# Altium project PCB_Project.PrjPcb (part 1 of 3)
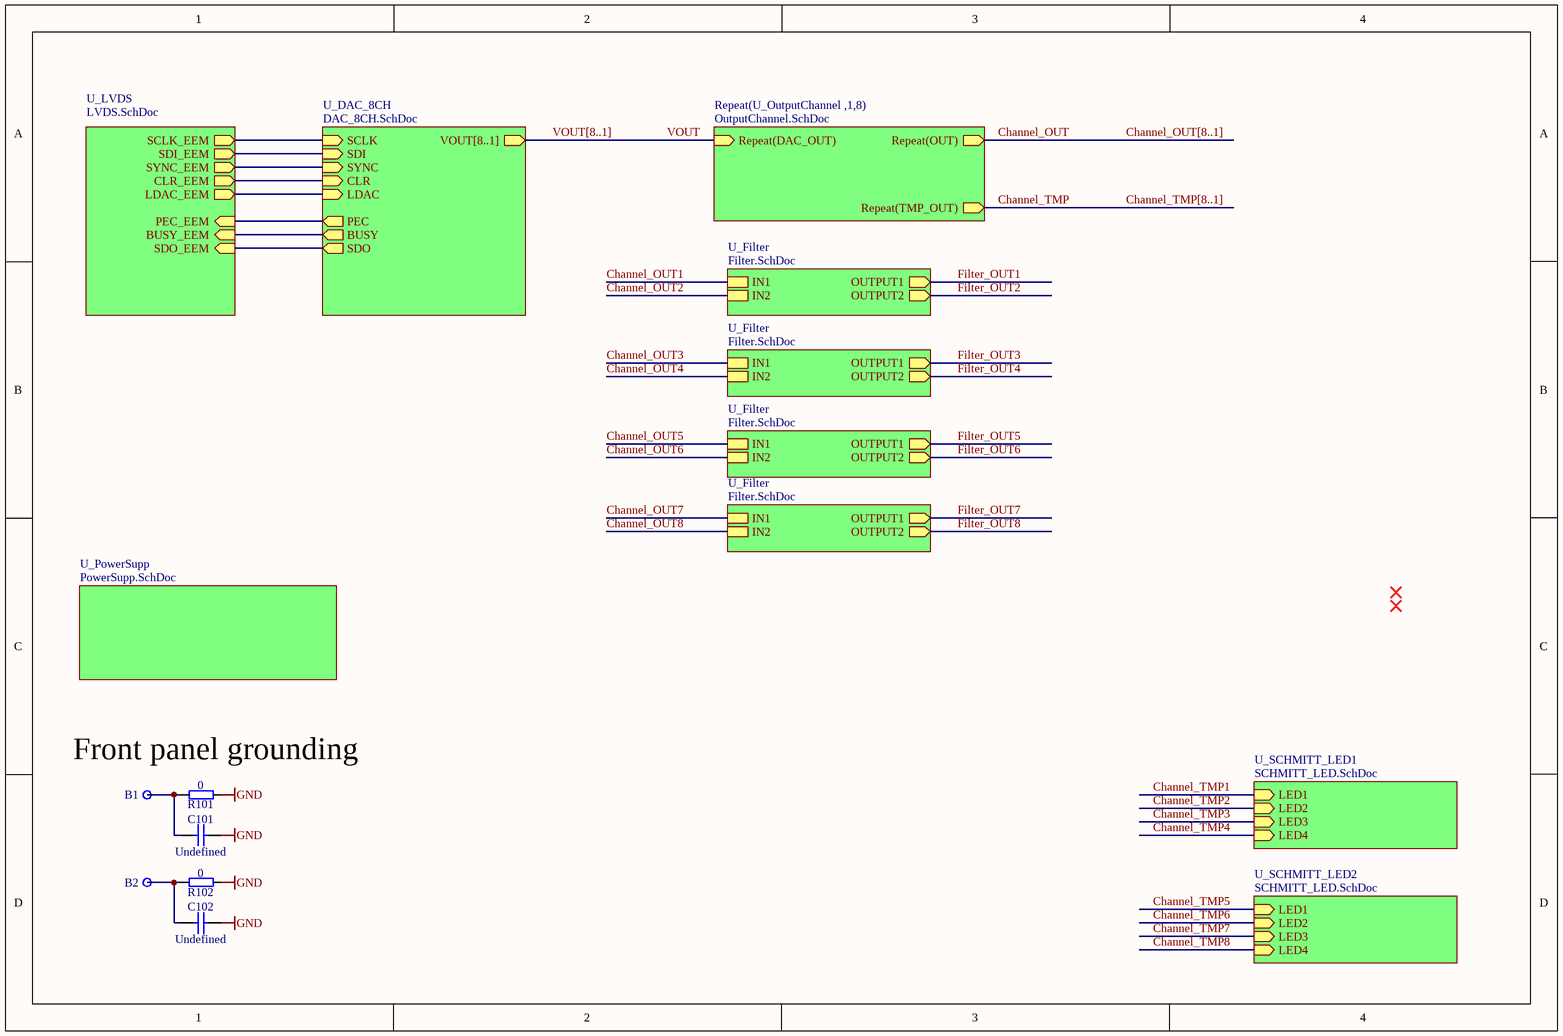
[diagram p0: Zapper.SchDoc]
7 sheets, 397 parts. Net scope: hierarchical (ports join the sheet entries above them; power ports are global).
Sheets:
  Zapper.SchDoc
    U_LVDS = LVDS.SchDoc
    U_DAC_8CH = DAC_8CH.SchDoc
    U_SCHMITT_LED1 = SCHMITT_LED.SchDoc
    U_SCHMITT_LED2 = SCHMITT_LED.SchDoc
    U_OutputChannel1 = OutputChannel.SchDoc
    U_OutputChannel2 = OutputChannel.SchDoc
    U_OutputChannel3 = OutputChannel.SchDoc
    U_OutputChannel4 = OutputChannel.SchDoc
    U_OutputChannel5 = OutputChannel.SchDoc
    U_OutputChannel6 = OutputChannel.SchDoc
    U_OutputChannel7 = OutputChannel.SchDoc
    U_OutputChannel8 = OutputChannel.SchDoc
    U_PowerSupp = PowerSupp.SchDoc
    U_Filter = Filter.SchDoc
    U_Filter = Filter.SchDoc
    U_Filter = Filter.SchDoc
    U_Filter = Filter.SchDoc

## Sheet Zapper.SchDoc
size A4

### Parts
B1  Plated Hole  [MTG270_500]  (value not drawn)
B2  Plated Hole  [MTG270_500]  (value not drawn)
C101  Undefined  [CAPC2012X135N]
C102  Undefined  [CAPC2012X135N]
R101  0  [RESC1608X55N]
R102  0  [RESC1608X55N]

### Sub-sheets
Repeat(U_OutputChannel ,1,8) = OutputChannel.SchDoc: Repeat(OUT) (out), Repeat(DAC_OUT) (in), Repeat(TMP_OUT) (out)
U_DAC_8CH = DAC_8CH.SchDoc: SCLK (in), SDI (in), SYNC (in), BUSY (out), CLR (in), LDAC (in), PEC (out), SDO (out), VOUT[8..1] (out)
U_Filter = Filter.SchDoc: IN1, IN2, OUTPUT1 (out), OUTPUT2 (out)
U_Filter = Filter.SchDoc: IN1, IN2, OUTPUT1 (out), OUTPUT2 (out)
U_Filter = Filter.SchDoc: IN1, IN2, OUTPUT1 (out), OUTPUT2 (out)
U_Filter = Filter.SchDoc: IN1, IN2, OUTPUT1 (out), OUTPUT2 (out)
U_LVDS = LVDS.SchDoc: SCLK_EEM (out), SDO_EEM (in), SDI_EEM (out), SYNC_EEM (out), CLR_EEM (out), BUSY_EEM (in), LDAC_EEM (out), PEC_EEM (in)
U_PowerSupp = PowerSupp.SchDoc: no entries
U_SCHMITT_LED1 = SCHMITT_LED.SchDoc: LED1 (in), LED2 (in), LED3 (in), LED4 (in)
U_SCHMITT_LED2 = SCHMITT_LED.SchDoc: LED1 (in), LED2 (in), LED3 (in), LED4 (in)

### Nets
GND: C101.2 C102.2 R101.1 R102.1
Channel_OUT: sheet Repeat(U_OutputChannel ,1,8)/Repeat(OUT)
Channel_TMP: sheet Repeat(U_OutputChannel ,1,8)/Repeat(TMP_OUT)
VOUT: sheet Repeat(U_OutputChannel ,1,8)/Repeat(DAC_OUT)
NetB1_1: B1.1 C101.1 R101.2
NetB2_1: B2.1 C102.1 R102.2
NetIC1_26: sheet U_LVDS/SYNC_EEM, sheet U_DAC_8CH/SYNC
NetIC1_28: sheet U_LVDS/SDO_EEM, sheet U_DAC_8CH/SDO
NetIC1_33: sheet U_LVDS/SDI_EEM, sheet U_DAC_8CH/SDI
NetIC1_36: sheet U_LVDS/SCLK_EEM, sheet U_DAC_8CH/SCLK
NetIC2_26: sheet U_LVDS/CLR_EEM, sheet U_DAC_8CH/CLR
NetIC2_28: sheet U_LVDS/BUSY_EEM, sheet U_DAC_8CH/BUSY
NetIC2_33: sheet U_LVDS/LDAC_EEM, sheet U_DAC_8CH/LDAC
NetIC2_35: sheet U_LVDS/PEC_EEM, sheet U_DAC_8CH/PEC

### Buses and harness runs
bus Channel_OUT[8..1]
bus Channel_TMP[8..1]
bus VOUT[8..1] = sheet U_DAC_8CH/VOUT[8..1]

### Notes on the sheet
- Front panel grounding

### Library data of the parts
B1 B2 = PLATED_HOLE2.7_PAD5.0: Single Terminal Socket; Part Description: Plated Through Hole: Hole Dia.=2.7mm Pad Dia.=5.0mm; Mounted: No; Part Number: PLATED_HOLE2.7_PAD5.0; Component Kind: Standard (No BOM); Component Type: Standard (No BOM); Pin Count: 1; Family: Plated Hole; Socket: No; SMD: No; Sense: No; Status: None; ComponentHeight: 0mm; HelpURL: Undefined; Author: CERN DEM JMW; CreateDate: 27.09.2011; LatestRevisionDate: 27.09.2011; PackageDescription: Plated Through Hole: Hole Dia.=2.7mm Pad Dia.=5.0mm
C101 C102 = CC0805_NO-VALUE: Non-polarised capacitor; Part Description: Reserved Footprint For 0805(2012) Chip Ceramic Capacitor; Mounted: No; Part Number: CC0805_NO-VALUE; Component Kind: Standard; Component Type: Standard; Pin Count: 2; Value: Undefined; Status: None; Manufacturer: Undefined; Manufacturer Part Number: CC0805_NO-VALUE; Case: 0805; Socket: No; SMD: Yes; Sense: No; Manufacturer1 ComponentHeight: 1.35mm; HelpURL: Undefined; Author: CERN DEM JLC; CreateDate: 10.12.2008; LatestRevisionDate: 11.09.2013
R101 R102 = R0603_0R_JUMPER: Resistor; Part Description: 1A (0.05R Max DC Resistance) Zero Ohm Jumper; Manufacturer: GENERIC; Manufacturer1 Part Number: NRC06Z0; PressFit: No; Part Number: R0603_0R_JUMPER; Component Kind: Standard; Component Type: Standard; Pin Count: 2; Value: 0; Status: Preferred; Manufacturer Part Number: R0603_0R_JUMPER; Case: 0603; Mounted: Yes; Sense: No; Socket: No; SMD: Yes; Manufacturer1 Example: NIC COMPONENT; Manufacturer1 ComponentHeight: 0.55mm; HelpURL: \\cern.ch\dfs\Applications\Altium\Datasheets\R0603_NIC_NRC.pdf; Author: CERN DEM JLC; CreateDate: 03.12.2007; LatestRevisionDate: 13.03.2008

## Sheet LVDS.SchDoc
size A4
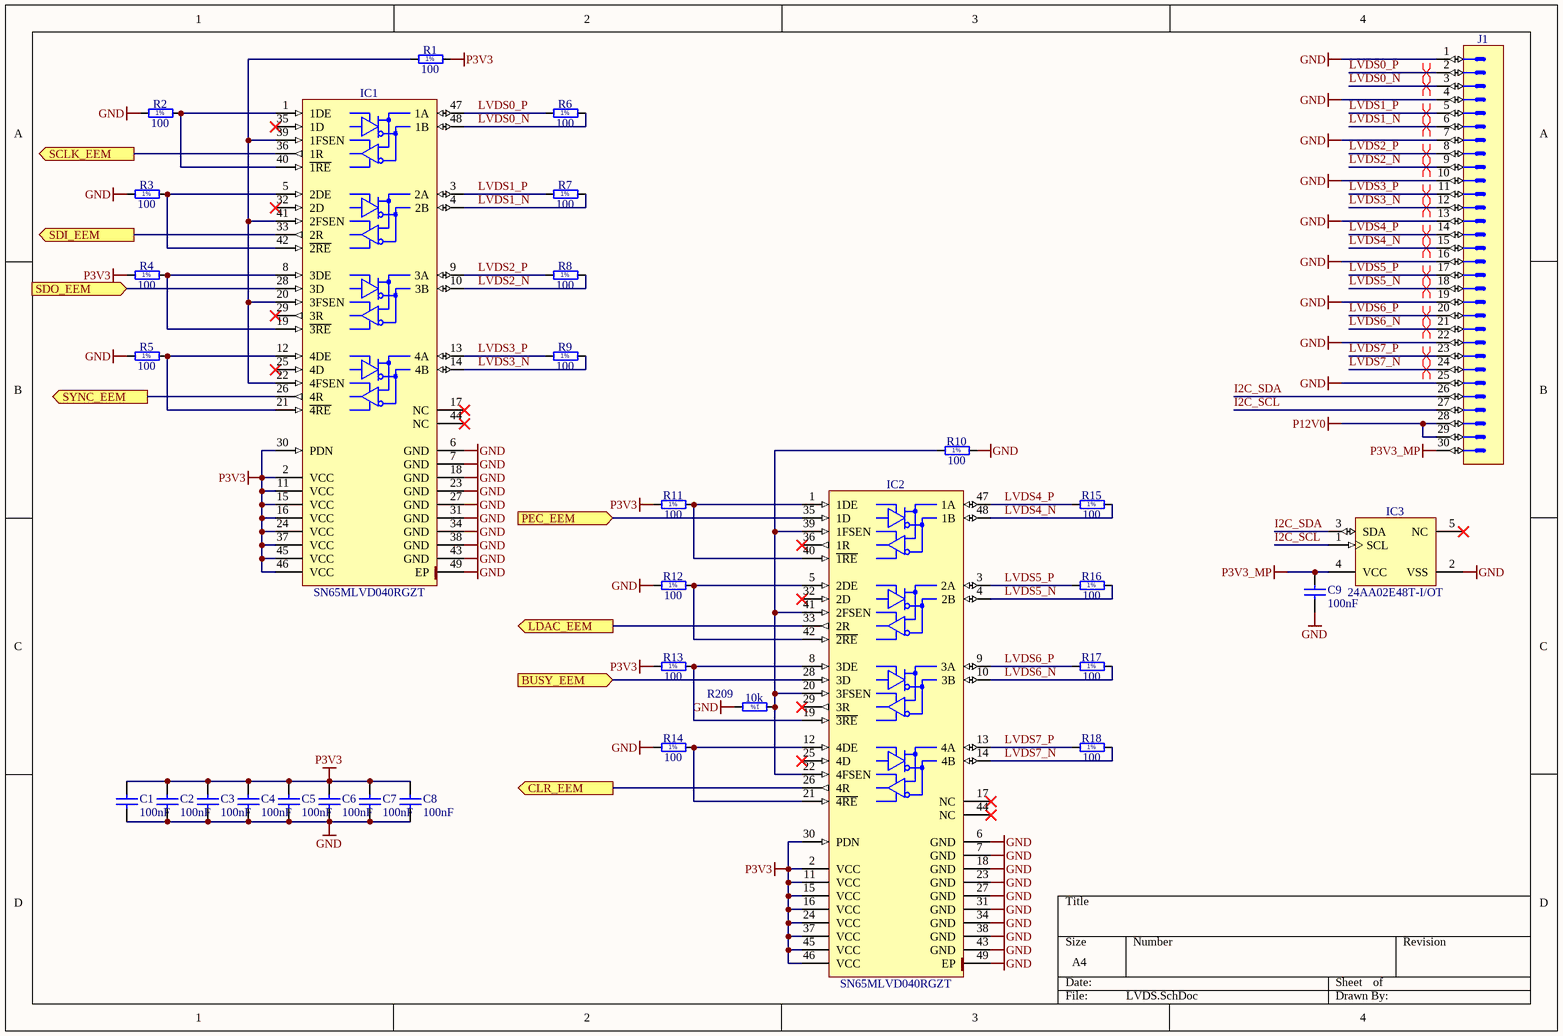
[diagram p1: LVDS.SchDoc]

### Parts
C1  100nF  [C0402C104K4RACTU]
C2  100nF  [C0402C104K4RACTU]
C3  100nF  [C0402C104K4RACTU]
C4  100nF  [C0402C104K4RACTU]
C5  100nF  [C0402C104K4RACTU]
C6  100nF  [C0402C104K4RACTU]
C7  100nF  [C0402C104K4RACTU]
C8  100nF  [C0402C104K4RACTU]
C9  100nF  [C0402C104K4RACTU]
IC1  SN65MLVD040RGZT  [QFN50P700X700X100-49N-S420]
IC2  SN65MLVD040RGZT  [QFN50P700X700X100-49N-S420]
IC3  24AA02E48T-I/OT  [SOT95P280X145-5N]
J1  Header 30  [3M_N2530-6002RB]  (value not drawn)
R1  100  [RESC1005X40N]
R2  100  [RESC1005X40N]
R3  100  [RESC1005X40N]
R4  100  [RESC1005X40N]
R5  100  [RESC1005X40N]
R6  100  [RESC1005X40N]
R7  100  [RESC1005X40N]
R8  100  [RESC1005X40N]
R9  100  [RESC1005X40N]
R10  100  [RESC1005X40N]
R11  100  [RESC1005X40N]
R12  100  [RESC1005X40N]
R13  100  [RESC1005X40N]
R14  100  [RESC1005X40N]
R15  100  [RESC1005X40N]
R16  100  [RESC1005X40N]
R17  100  [RESC1005X40N]
R18  100  [RESC1005X40N]
R209  10k  [RESC1005X40N]

### Ports
BUSY_EEM (in), CLR_EEM (out), LDAC_EEM (out), PEC_EEM (in), SCLK_EEM (out), SDI_EEM (out), SDO_EEM (in), SYNC_EEM (out)

### Nets
GND: C1.1 C2.1 C3.1 C4.1 C5.1 C6.1 C7.1 C8.1 C9.1 IC1.6(GND) IC1.7(GND) IC1.18(GND) IC1.23(GND) IC1.27(GND) IC1.31(GND) IC1.34(GND) IC1.38(GND) IC1.43(GND) IC1.49(EP) IC2.6(GND) IC2.7(GND) IC2.18(GND) IC2.23(GND) IC2.27(GND) IC2.31(GND) IC2.34(GND) IC2.38(GND) IC2.43(GND) IC2.49(EP) IC3.2(VSS) J1.1 J1.4 J1.7 J1.10 J1.13 J1.16 J1.19 J1.22 J1.25 R2.1 R3.1 R5.1 R10.2 R12.1 R14.1 R209.2
P3V3: C1.2 C2.2 C3.2 C4.2 C5.2 C6.2 C7.2 C8.2 IC1.2(VCC) IC1.11(VCC) IC1.15(VCC) IC1.16(VCC) IC1.24(VCC) IC1.30(PDN) IC1.37(VCC) IC1.45(VCC) IC1.46(VCC) IC2.2(VCC) IC2.11(VCC) IC2.15(VCC) IC2.16(VCC) IC2.24(VCC) IC2.30(PDN) IC2.37(VCC) IC2.45(VCC) IC2.46(VCC) R1.2 R4.1 R11.1 R13.1
P3V3_MP: C9.2 IC3.4(VCC) J1.30
P12V0: J1.28 J1.29
I2C_SCL: IC3.1(SCL) J1.27
I2C_SDA: IC3.3(SDA) J1.26
LVDS0_N: IC1.48(1B) J1.3 R6.2
LVDS0_P: IC1.47(1A) J1.2 R6.1
LVDS1_N: IC1.4(2B) J1.6 R7.2
LVDS1_P: IC1.3(2A) J1.5 R7.1
LVDS2_N: IC1.10(3B) J1.9 R8.2
LVDS2_P: IC1.9(3A) J1.8 R8.1
LVDS3_N: IC1.14(4B) J1.12 R9.2
LVDS3_P: IC1.13(4A) J1.11 R9.1
LVDS4_N: IC2.48(1B) J1.15 R15.2
LVDS4_P: IC2.47(1A) J1.14 R15.1
LVDS5_N: IC2.4(2B) J1.18 R16.2
LVDS5_P: IC2.3(2A) J1.17 R16.1
LVDS6_N: IC2.10(3B) J1.21 R17.2
LVDS6_P: IC2.9(3A) J1.20 R17.1
LVDS7_N: IC2.14(4B) J1.24 R18.2
LVDS7_P: IC2.13(4A) J1.23 R18.1
NetIC1_1: IC1.1(1DE) IC1.40(~{1RE}) R2.2
NetIC1_5: IC1.5(2DE) IC1.42(~{2RE}) R3.2
NetIC1_8: IC1.8(3DE) IC1.19(~{3RE}) R4.2
NetIC1_12: IC1.12(4DE) IC1.21(~{4RE}) R5.2
NetIC1_20: IC1.20(3FSEN) IC1.22(4FSEN) IC1.39(1FSEN) IC1.41(2FSEN) R1.1
NetIC1_26: IC1.26(4R) ; port SYNC_EEM
NetIC1_28: IC1.28(3D) ; port SDO_EEM
NetIC1_33: IC1.33(2R) ; port SDI_EEM
NetIC1_36: IC1.36(1R) ; port SCLK_EEM
NetIC2_1: IC2.1(1DE) IC2.40(~{1RE}) R11.2
NetIC2_5: IC2.5(2DE) IC2.42(~{2RE}) R12.2
NetIC2_8: IC2.8(3DE) IC2.19(~{3RE}) R13.2
NetIC2_12: IC2.12(4DE) IC2.21(~{4RE}) R14.2
NetIC2_20: IC2.20(3FSEN) IC2.22(4FSEN) IC2.39(1FSEN) IC2.41(2FSEN) R10.1 R209.1
NetIC2_26: IC2.26(4R) ; port CLR_EEM
NetIC2_28: IC2.28(3D) ; port BUSY_EEM
NetIC2_33: IC2.33(2R) ; port LDAC_EEM
NetIC2_35: IC2.35(1D) ; port PEC_EEM

Not connected (* = marked no-connect by the designer): IC1 17(NC)* 25(4D)* 29(3R)* 32(2D)* 35(1D)* 44(NC)*; IC2 17(NC)* 25(4D)* 29(3R)* 32(2D)* 36(1R)* 44(NC)*; IC3 5(NC)*

### Layout directives
differential pair: LVDS0_N, LVDS0_P, LVDS1_N, LVDS1_P, LVDS2_N, LVDS2_P, LVDS3_N, LVDS3_P, LVDS4_N, LVDS4_P, LVDS5_N, LVDS5_P, LVDS6_N, LVDS6_P, LVDS7_N, LVDS7_P

### Notes on the sheet
- (in symbol R0402_10K_1%_0.0625W_100PPM) 1%
- (in symbol R0402_100R_1%_0.1W_100PPM) 1%

### Library data of the parts
C1-C9 = C0402C104K4RACTU: Capacitor; Ceramic; Cap; .100uF; Tol 10%; SMT; Vol-Rtg 16V; X7R; Tape and Reel; Manufacturer 1: KEMET; Dissipation Factor: 3.5%; Supplier 1: Digi-Key; Manufacturer Part Number 1: C0402C104K4RACTU; Stock 1: 636137; Pricing 1: 1=0,10000, 10=0,04000, 50=0,02180, 100=0,01780, 500=0,01270, 1000=0,00998, 2500=0,00908, 5000=0,00835 (USD); RoHS: Yes; Mount: Surface Mount; Case/Package: 0402; Case Code (Imperial): 0402; Case Code (Metric): 1005; Contact Plating: Tin,Matte; Min Operating Temperature: -55°C; Max Operating Temperature: 125°C; Capacitance: 100nF; Tolerance: 10%; Packaging: Tape and Reel; Voltage Rating (DC): 16V; Dielectric: X7R; Package Quantity: 10000; Voltage Rating: 16V; Termination: SMD/SMT; Length: 1mm; Height: 0.5mm; Width: 0.5mm; Depth: 0.5mm; Radiation Hardening: No; ComponentLink1URL: https://datasheet.ciiva.com/45846/docfinderpartnumberc0402c102k5ractu-45846919.pdf?src-supplier=Onlinecomponents.com; ComponentLink1Description: https://datasheet.ciiva.com/45846/docfinderpartnumberc0402c102k5ractu-45846919.pdf?src-supplier=Onlinecomponents.com; ComponentLink2URL: https://datasheet.ciiva.com/18192/getdatasheetpartid-385384-18192412.pdf?src-supplier=Verical; ComponentLink2Description: https://datasheet.ciiva.com/18192/getdatasheetpartid-385384-18192412.pdf?src-supplier=Verical; Supplier Part Number 1: 399-3521-1-ND
IC1 IC2 = SN65MLVD040RGZT: 4-Channel Half-Duplex M-LVDS Line Transceiver; Manufacturer: TEXAS INSTRUMENTS; PressFit: No; Bonding: No; Part Number: SN65MLVD040RGZT; Component Kind: Standard; Component Type: Standard; Device: SN65MLVD040RGZT; PackageDescription: QFN, 0.50mm Pitch, Square; 48 Pin, 7.00mm L X 7.00mm W X 1mm H body (W/Thermal Tab 4.2mm X 4.2mm), IPC Medium Density; Part Description: 4-Channel Half-Duplex M-LVDS Line Transceiver; Manufacturer Part Number: SN65MLVD040RGZT; Pin Count: 49; Case: QFN48; Mounted: Yes; Socket: No; SMD: Yes; Sense: No; ComponentHeight: 1mm; Author: CERN DEM JLC; HelpURL: \\cern.ch\dfs\Applications\Altium\Datasheets\SN65MLVD040RGZT.pdf; CreateDate: 17.03.2011; LatestRevisionDate: 17.03.2011
IC3 = 24AA02E48T-I/OT: 1.7V-5.5V, 2K I2C Serial EEPROM With EUI-48 Node Identity; Manufacturer: MICROCHIP TECHNOLOGY; PressFit: No; Bonding: No; Part Number: 24AA02E48T-I/OT; Component Kind: Standard; Component Type: Standard; Device: 24AA02E48T-I/OT; PackageDescription: SOT, 0.95mm pitch; 5 pin, 1.60mm W X 2.90mm L X 1.45mm H body, IPC Medium Density; Part Description: 1.7V-5.5V, 2K I2C Serial EEPROM With EUI-48 Node Identity; Manufacturer Part Number: 24AA02E48T-I/OT; Pin Count: 5; Case: SOT23-5; Mounted: Yes; Socket: No; SMD: Yes; Sense: No; ComponentHeight: 1.45mm; HelpURL: \\cern.ch\dfs\Applications\Altium\Datasheets\24AA02E48T-I-OT.pdf; Author: CERN DEM MR; CreateDate: 31.03.2016; LatestRevisionDate: 31.03.2016
J1 = 3M_N2530-6002RB: Connector 30 Male; Part Description: 30 Contacts - Straight .100'' x .100'' Low Profile Four-Wall Header, 2500 Series; Manufacturer: 3M; PressFit: No; Part Number: 3M_N2530-6002RB; Component Kind: Standard; Component Type: Standard; Pin Count: 30; Family: Header 30; Mounted: Yes; Socket: No; SMD: No; Sense: No; Status: None; Manufacturer Part Number: N2530-6002RB; ComponentHeight: 10.03mm; HelpURL: \\cern.ch\dfs\Applications\Altium\Datasheets\3M_N2530-6002RB.pdf; Author: CERN DEM JLC; CreateDate: 11.02.2009; LatestRevisionDate: 11.08.2009
R1-R18 = R0402_100R_1%_0.1W_100PPM: Resistor - 1%; Part Description: General Purpose Thick Film Chip Resistor; Manufacturer: GENERIC; Manufacturer Part Number: R0402_100R_1%_0.1W_100PPM_50V; Manufacturer1 Part Number: ERJ2RKF1000X; Power: 0.1W; TC: ±100ppm/°C; Voltage: 50V; PressFit: No; Part Number: R0402_100R_1%_0.1W_100PPM; Component Kind: Standard; Component Type: Standard; Pin Count: 2; Value: 100; Status: Not Recommended; Tolerance: ±1%; Case: 0402; Mounted: Yes; Sense: No; Socket: No; SMD: Yes; Manufacturer1 Example: PANASONIC; Manufacturer1 ComponentHeight: 0.4mm; HelpURL: \\cern.ch\dfs\Applications\Altium\Datasheets\R0402_PANASONIC_ERJ2RK.pdf; Author: CERN DEM JLC; CreateDate: 12.12.2013; LatestRevisionDate: 03.03.2015
R209 = R0402_10K_1%_0.0625W_100PPM: Resistor - 1%; Part Description: General Purpose Thick Film Chip Resistor; Manufacturer: GENERIC; Manufacturer1 Part Number: 232270671003L; TC: ±100ppm/°C; PressFit: No; Part Number: R0402_10K_1%_0.0625W_100PPM; Component Kind: Standard; Component Type: Standard; Pin Count: 2; Value: 10k; Status: Not Recommended; Power: 0.0625W; Tolerance: ±1%; Manufacturer Part Number: R0402_10K_1%_0.0625W_100PPM; Case: 0402; Mounted: Yes; Sense: No; Socket: No; SMD: Yes; Manufacturer1 Example: YAGEO PHYCOMP; Manufacturer1 ComponentHeight: 0.4mm; HelpURL: \\cern.ch\dfs\Applications\Altium\Datasheets\R0402_Phycomp_RC0402.pdf; Author: CERN DEM JLC; CreateDate: 03.12.2007; LatestRevisionDate: 17.10.2012

## Sheet DAC_8CH.SchDoc
size A4
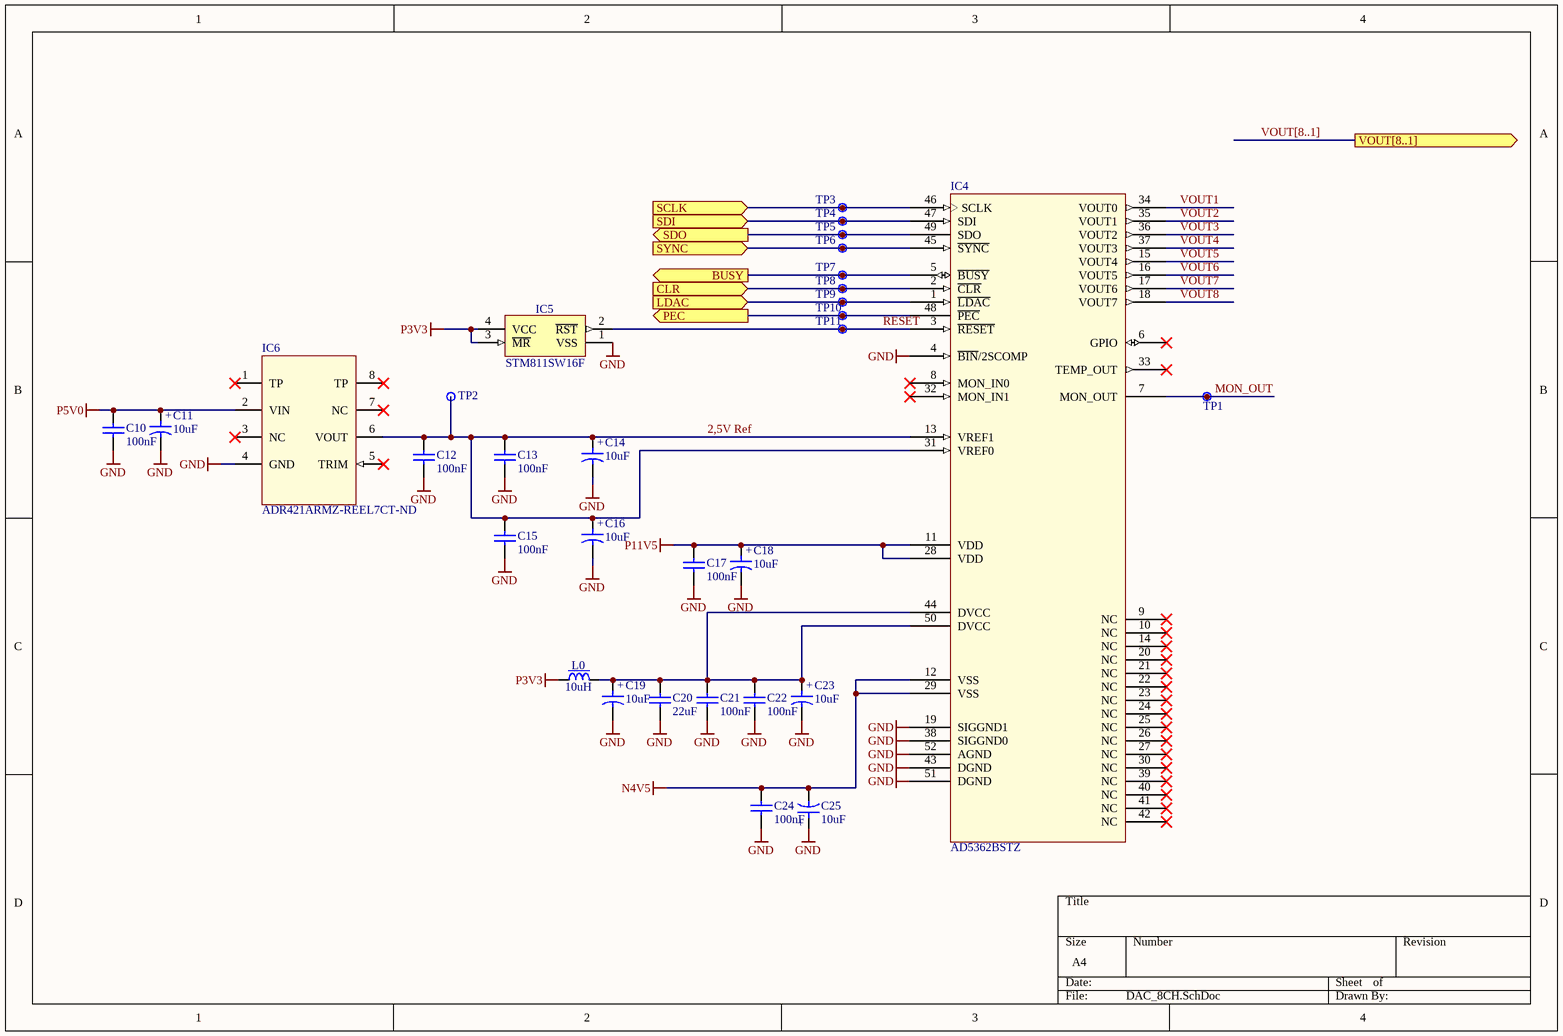
[diagram p2: DAC_8CH.SchDoc]

### Parts
C10  100nF  [C0402C104K4RACTU]
C11  10uF  [TCJT106M016R0200]
C12  100nF  [C0402C104K4RACTU]
C13  100nF  [C0402C104K4RACTU]
C14  10uF  [TCJT106M016R0200]
C15  100nF  [C0402C104K4RACTU]
C16  10uF  [TCJT106M016R0200]
C17  100nF  [C0402C104K4RACTU]
C18  10uF  [TCJT106M016R0200]
C19  10uF  [TCJT106M016R0200]
C20  22uF  [GRM219R61C226ME15K]
C21  100nF  [C0402C104K4RACTU]
C22  100nF  [C0402C104K4RACTU]
C23  10uF  [TCJT106M016R0200]
C24  100nF  [C0402C104K4RACTU]
C25  10uF  [TCJT106M016R0200]
IC4  AD5362BSTZ  [ST-52_L]
IC5  STM811SW16F  [SOT143N]
IC6  Supplier Part Number 1: ADR421ARMZ-REEL7CT-ND  [ADI-RM-8_N]  (hidden comment: ADR421ARMZ-REEL7)
L0  10uH  [IND_MURATA-PS_8400]
TP1  Test Point  [TPS127]  (value not drawn)
TP2  Test Point  [TPS127]  (value not drawn)
TP3  Test Point  [TPS127]  (value not drawn)
TP4  Test Point  [TPS127]  (value not drawn)
TP5  Test Point  [TPS127]  (value not drawn)
TP6  Test Point  [TPS127]  (value not drawn)
TP7  Test Point  [TPS127]  (value not drawn)
TP8  Test Point  [TPS127]  (value not drawn)
TP9  Test Point  [TPS127]  (value not drawn)
TP10  Test Point  [TPS127]  (value not drawn)
TP11  Test Point  [TPS127]  (value not drawn)

### Ports
BUSY (out), CLR (in), LDAC (in), PEC (out), SCLK (in), SDI (in), SDO (out), SYNC (in), VOUT[8..1] (out)

### Nets
GND: C10.1 C11.2 C12.1 C13.1 C14.2 C15.1 C16.2 C17.1 C18.2 C19.2 C20.1 C21.1 C22.1 C23.2 C24.1 C25.1 IC4.4(~{BIN}/2SCOMP) IC4.19(SIGGND1) IC4.38(SIGGND0) IC4.43(DGND) IC4.51(DGND) IC4.52(AGND) IC5.1(VSS) IC6.4(GND)
N4V5: C24.2 C25.2 IC4.12(VSS) IC4.29(VSS)
P3V3: IC5.3(~{MR}) IC5.4(VCC) L0.1
P5V0: C10.2 C11.1 IC6.2(VIN)
P11V5: C17.2 C18.1 IC4.11(VDD) IC4.28(VDD)
2,5V Ref: C12.2 C13.2 C14.1 C15.2 C16.1 IC4.13(VREF1) IC4.31(VREF0) IC6.6(VOUT) TP2.1
MON_OUT: IC4.7(MON_OUT) TP1.1
~{RESET}: IC4.3(~{RESET}) IC5.2(~{RST}) TP11.1
VOUT1: IC4.34(VOUT0)
VOUT2: IC4.35(VOUT1)
VOUT3: IC4.36(VOUT2)
VOUT4: IC4.37(VOUT3)
VOUT5: IC4.15(VOUT4)
VOUT6: IC4.16(VOUT5)
VOUT7: IC4.17(VOUT6)
VOUT8: IC4.18(VOUT7)
NetC19_1: C19.1 C20.2 C21.2 C22.2 C23.1 IC4.44(DVCC) IC4.50(DVCC) L0.2
NetIC1_26: IC4.45(~{SYNC}) TP6.1 ; port SYNC
NetIC1_28: IC4.49(SDO) TP5.1 ; port SDO
NetIC1_33: IC4.47(SDI) TP4.1 ; port SDI
NetIC1_36: IC4.46(SCLK) TP3.1 ; port SCLK
NetIC2_26: IC4.2(~{CLR}) TP8.1 ; port CLR
NetIC2_28: IC4.5(~{BUSY}) TP7.1 ; port BUSY
NetIC2_33: IC4.1(~{LDAC}) TP9.1 ; port LDAC
NetIC2_35: IC4.48(~{PEC}) TP10.1 ; port PEC

Not connected (* = marked no-connect by the designer): IC4 6(GPIO)* 8(MON_IN0)* 9(NC)* 10(NC)* 14(NC)* 20(NC)* 21(NC)* 22(NC)* 23(NC)* 24(NC)* 25(NC)* 26(NC)* 27(NC)* 30(NC)* 32(MON_IN1)* 33(TEMP_OUT)* 39(NC)* 40(NC)* 41(NC)* 42(NC)*; IC6 1(TP)* 3(NC)* 5(TRIM)* 7(NC)* 8(TP)*

### Buses and harness runs
bus VOUT[8..1] = port VOUT[8..1]

### Notes on the sheet
- (in symbol TCJT106M016R0200) +

### Library data of the parts
C10 C12 C13 C15 C17 C21 C22 C24 = C0402C104K4RACTU: as C1 on sheet LVDS; Supplier 1: Digi-Key; Manufacturer Part Number 1: C0402C104K4RACTU; Stock 1: 636137; Pricing 1: 1=0,10000, 10=0,04000, 50=0,02180, 100=0,01780, 500=0,01270, 1000=0,00998, 2500=0,00908, 5000=0,00835 (USD); RoHS: Yes; Mount: Surface Mount; Case/Package: 0402; Case Code (Imperial): 0402; Case Code (Metric): 1005; Contact Plating: Tin,Matte; Min Operating Temperature: -55°C; Max Operating Temperature: 125°C; Capacitance: 100nF; Tolerance: 10%; Packaging: Tape and Reel; Voltage Rating (DC): 16V; Dielectric: X7R; Package Quantity: 10000; Voltage Rating: 16V; Termination: SMD/SMT; Length: 1mm; Height: 0.5mm; Width: 0.5mm; Depth: 0.5mm; Radiation Hardening: No; ComponentLink1URL: https://datasheet.ciiva.com/45846/docfinderpartnumberc0402c102k5ractu-45846919.pdf?src-supplier=Onlinecomponents.com; ComponentLink1Description: https://datasheet.ciiva.com/45846/docfinderpartnumberc0402c102k5ractu-45846919.pdf?src-supplier=Onlinecomponents.com; ComponentLink2URL: https://datasheet.ciiva.com/18192/getdatasheetpartid-385384-18192412.pdf?src-supplier=Verical; ComponentLink2Description: https://datasheet.ciiva.com/18192/getdatasheetpartid-385384-18192412.pdf?src-supplier=Verical; Supplier Part Number 1: 399-3521-1-ND
C11 C14 C16 C18 C19 C23 C25 = TCJT106M016R0200: CAP TANT POLY 10UF 16V 1210; Manufacturer 1: Kyocera AVX; Tolerance: 20%; ESR (Equivalent Series Resistance): 200mR; Leakage Current: 16uA; Dissipation Factor: 6%; Supplier 1: Digi-Key; Manufacturer Part Number 1: TCJT106M016R0200; Stock 1: 1486; Pricing 1: 1=0,85000, 10=0,62700, 50=0,50140, 100=0,42980, 500=0,34026, 1000=0,28653 (USD); RoHS: Yes; Mount: Surface Mount; Case/Package: 1210; Case Code (Imperial): 1210; Case Code (Metric): 3528; Min Operating Temperature: -55°C; Max Operating Temperature: 125°C; Capacitance: 10uF; Termination: SMD/SMT; Voltage: 16V; Packaging: Tape and Reel; Package Quantity: 2500; Voltage Rating (DC): 16V; Voltage Rating: 16V; Length: 3.5mm; Height: 1.2mm; Depth: 2.8mm; Height - Seated (Max): 0.047inch; Width: 2.8mm; Radiation Hardening: No; ComponentLink1URL: https://datasheet.ciiva.com/11793/0900766b80eff593-11793120.pdf?src-supplier=RSComponents; ComponentLink1Description: https://datasheet.ciiva.com/11793/0900766b80eff593-11793120.pdf?src-supplier=RSComponents; ComponentLink2URL: https://datasheet.ciiva.com/6238/tcj-6238575.pdf?src-supplier=Digi-Key; ComponentLink2Description: https://datasheet.ciiva.com/6238/tcj-6238575.pdf?src-supplier=Digi-Key; ComponentLink3URL: https://datasheet.ciiva.com/11231/tcj-11231109.pdf?src-supplier=Avnet; ComponentLink3Description: https://datasheet.ciiva.com/11231/tcj-11231109.pdf?src-supplier=Avnet; Supplier Part Number 1: 478-11587-1-ND
C20 = GRM219R61C226ME15K: CAP CER 22uF 16V X5R 20% SMD 0805 85°C Embossed T/R; Manufacturer 1: Murata; Supplier 1: Digi-Key; Manufacturer Part Number 1: GRM219R61C226ME15K; Stock 1: 9158; Pricing 1: 1=0,46000, 10=0,32500, 50=0,24560, 100=0,21400, 500=0,15852, 1000=0,13473, 2500=0,12681, 5000=0,11888 (USD); RoHS: No; Voltage Rating (DC): 16V; Dielectric: X5R; Tolerance: 20%; Capacitance: 22uF; Length: 2mm; Width: 1.25mm; Thickness: 850um; Supplier Part Number 1: 490-GRM219R61C226ME15KCT-ND
IC4 = AD5362BSTZ: IC, 16BIT DAC, 8CH, SERIAL, 52LFCSP; Manufacturer 1: Analog Devices; Resolution: 16b; Settling Time: 20us; Integral Nonlinearity (INL): 4LSB; Output Type: Voltage; Interface: SPI,Serial; Number of Bits: 16; Sampling Rate: 540KS/s; Number of DAC Channels: 8; Max Supply Voltage: 16.5V; Min Supply Voltage: 8V; Max Power Dissipation: 209mW; Dual Supply Voltage: 15V; Differential Output: No; Polarity: Bipolar,Unipolar; Max Input Voltage: 5V; Min Input Voltage: 2V; Max Output Voltage: 20V; Slew Rate: 1V/µs; Nominal Supply Current: 8.5mA; Supplier 1: Arrow; Manufacturer Part Number 1: AD5362BSTZ; Stock 1: 15; Pricing 1: 1=43,05000, 5=41,82000, 10=40,47990, 25=37,43000, 50=36,88000, 100=33,58000, 250=32,20000 (USD); RoHS: Yes; Case/Package: LQFP; Number of Pins: 52; Contact Plating: Tin,Matte; Min Operating Temperature: -40°C; Max Operating Temperature: 85°C; Package Quantity: 1; Packaging: Tray; Max Dual Supply Voltage: 16.5V; Number of Converters: 8; Number of D/A Converters: 8; Power Dissipation: 209mW; Min Output Voltage: 8V; Number of Channels: 8; Number of Outputs: 8; Termination: SMD/SMT; Length: 10mm; Height: 1.4mm; Width: 10mm; Radiation Hardening: No; Lead Free: Contains Lead; REACH SVHC: No SVHC; ComponentLink1URL: https://datasheet.ciiva.com/1145/1789185-1145089.pdf?src-supplier=Avnet; ComponentLink1Description: https://datasheet.ciiva.com/1145/1789185-1145089.pdf?src-supplier=Avnet; ComponentLink2URL: https://datasheet.ciiva.com/1145/1789185-1145089.pdf?src-supplier=Farnell; ComponentLink2Description: https://datasheet.ciiva.com/1145/1789185-1145089.pdf?src-supplier=Farnell; ComponentLink3URL: https://datasheet.ciiva.com/26802/ad5362bstz-26802160.pdf?src-supplier=IIIC; ComponentLink3Description: https://datasheet.ciiva.com/26802/ad5362bstz-26802160.pdf?src-supplier=IIIC; ComponentLink4URL: https://datasheet.ciiva.com/1142/ad5362-5363-1142361.pdf?src-supplier=Element14; ComponentLink4Description: https://datasheet.ciiva.com/1142/ad5362-5363-1142361.pdf?src-supplier=Element14; ComponentLink5URL: https://datasheet.ciiva.com/1368/ad5362-5363-1368393.pdf?src-supplier=Digi-Key; ComponentLink5Description: https://datasheet.ciiva.com/1368/ad5362-5363-1368393.pdf?src-supplier=Digi-Key; ComponentLink6URL: https://datasheet.ciiva.com/8067/ad5362-5363-8067722.pdf?src-supplier=Element14; ComponentLink6Description: https://datasheet.ciiva.com/8067/ad5362-5363-8067722.pdf?src-supplier=Element14; ComponentLink7URL: https://datasheet.ciiva.com/15146/getdatasheetpartid-64274-15146331.pdf?src-supplier=Verical; ComponentLink7Description: https://datasheet.ciiva.com/15146/getdatasheetpartid-64274-15146331.pdf?src-supplier=Verical; ComponentLink8URL: https://datasheet.ciiva.com/16598/ad5362-5363-16598797.pdf?src-supplier=Avnet+Europe; ComponentLink8Description: https://datasheet.ciiva.com/16598/ad5362-5363-16598797.pdf?src-supplier=Avnet+Europe; Supplier Part Number 1: AD5362BSTZ
IC5 = STM811SW16F: Microprocessor Reset Circuit; Part Description: 2.93V Reset Threshold Voltage Microprocessor Reset Circuit; Manufacturer: ST MICROELECTRONICS; PressFit: No; Bonding: No; Part Number: STM811SW16F; Component Kind: Standard; Component Type: Standard; Device: STM811SW16F; PackageDescription: SOT143, 4-Leads, Body 3.0x2.6mm (max), Pitch 1.92mm, IPC Medium Density; Manufacturer Part Number: STM811SW16F; Pin Count: 4; Case: SOT143; Mounted: Yes; Socket: No; SMD: Yes; Sense: No; ComponentHeight: 1.12mm; Author: CERN DEM JLC; HelpURL: \\cern.ch\dfs\Applications\Altium\Datasheets\STM811SW16F.pdf; CreateDate: 17.11.2016; LatestRevisionDate: 17.11.2016
IC6 = ADR421ARMZ-REEL7: V-Ref Precision 2.5V 10mA 8-Pin MSOP T/R; Manufacturer 1: Analog Devices; Temperature Coefficient: 10ppm/°C; Max Input Voltage: 18V; Nominal Supply Current: 500uA; Tolerance: 0.12%; Reference Type: Series; Number of Channels: 1; Output Type: Fixed; Supplier 1: Digi-Key; Manufacturer Part Number 1: ADR421ARMZ-REEL7; Stock 1: 0; Pricing 1: 1=6,62000, 10=5,97700, 25=5,69920, 100=4,72600, 250=4,30900, 500=4,03100 (USD); RoHS: Yes; Mount: Surface Mount; Case/Package: MSOP; Number of Pins: 8; Min Operating Temperature: -40°C; Max Operating Temperature: 125°C; Output Voltage: 2.5V; Max Output Current: 10mA; Output Current: 10mA; Packaging: Tape and Reel; Max Output Voltage: 2.5V; Package Quantity: 1000; Min Output Voltage: 2.5V; Operating Supply Current: 500uA; Quiescent Current: 500uA; Length: 3.2mm; Height: 0.95mm; Width: 3.2mm; Radiation Hardening: No; Lead Free: Contains Lead; ComponentLink1URL: https://datasheet.ciiva.com/26889/adr421armz-reel7-26889000.pdf?src-supplier=IIIC; ComponentLink1Description: https://datasheet.ciiva.com/26889/adr421armz-reel7-26889000.pdf?src-supplier=IIIC
L0 = IND_10UH_10%_MURATA-PS_8400: Inductor With Core; Part Description: Miniature Surface Mount Power Inductor (8400 Series); Manufacturer: MURATA POWER SOLUTIONS; Manufacturer Part Number: 84103C; Power: 950mA; Resistance: 0.24R; Tolerance: ±10%; Part Number: IND_10UH_10%_MURATA-PS_8400; Component Kind: Standard; Component Type: Standard; Pin Count: 2; Value: 10uH; Status: None; Mounted: Yes; Socket: No; SMD: Yes; Sense: No; ComponentHeight: 2.9mm; HelpURL: \\cern.ch\dfs\Applications\Altium\Datasheets\IND_MURATA-PS_8400.pdf; Author: CERN DEM JLC; CreateDate: 02.07.2012; LatestRevisionDate: 02.07.2012
TP1-TP11 = SMD_PAD_1.27X1.27MM: Part Description: 1.27mm x 1.27mm PCB Copper Area (SMD Test Point); Mounted: No; Part Number: SMD_PAD_1.27X1.27MM; Component Kind: Standard (No BOM); Component Type: Standard (No BOM); Pin Count: 1; Family: Test Point; Socket: No; SMD: Yes; Sense: No; Status: None; ComponentHeight: 0mm; HelpURL: Undefined; Author: CERN DEM JLC; CreateDate: 12.01.2008; LatestRevisionDate: 12.01.2008; PackageDescription: 1.27mm x 1.27mm PCB Copper Area (SMD Test Point)

## Sheet SCHMITT_LED.SchDoc
size A4
Used 2 times, as channels U_SCHMITT_LED1, U_SCHMITT_LED2. Parts and nets are listed once, with the designators drawn on the sheet.
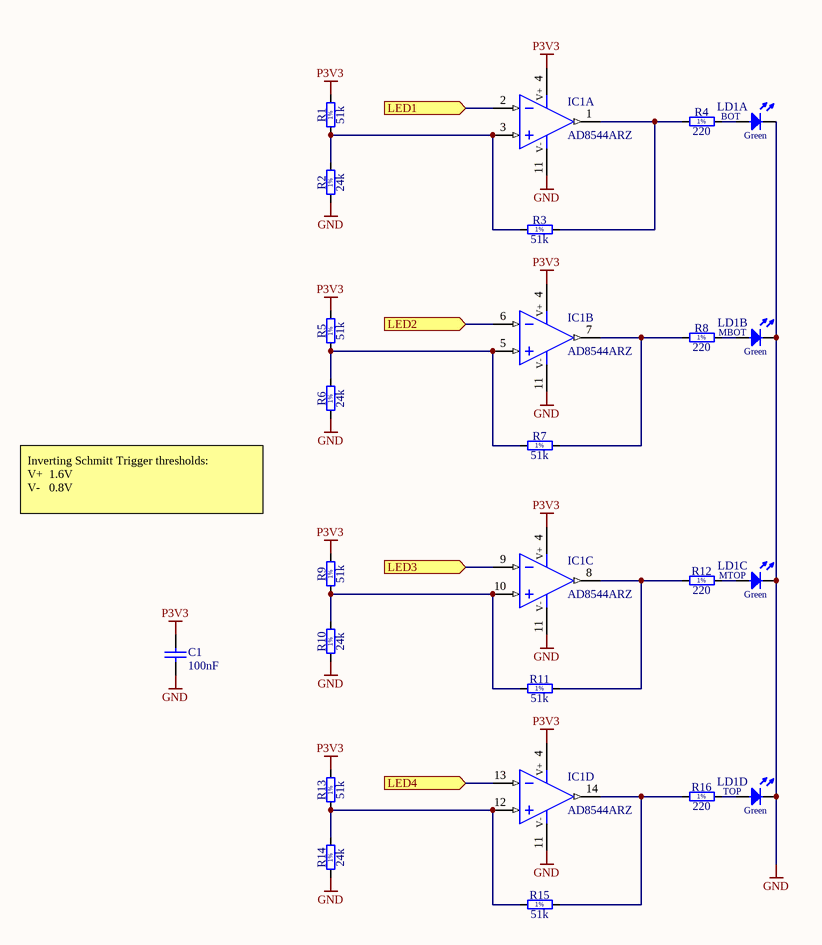
[diagram p3: SCHMITT_LED.SchDoc]

### Parts
C1  100nF  [C0402C104K4RACTU]
IC1  AD8544ARZ  [SOIC127P600X175-14N]  (parts A,B,C,D of 4)
LD1  Green  [LED_BIVAR_H485CGDL]  (value not drawn)  (parts A,B,C,D of 4)
R1  51k  [RESC1608X55N]
R2  24k  [RESC1608X55N]
R3  51k  [RESC1608X55N]
R4  220  [RESC1608X55N]
R5  51k  [RESC1608X55N]
R6  24k  [RESC1608X55N]
R7  51k  [RESC1608X55N]
R8  220  [RESC1608X55N]
R9  51k  [RESC1608X55N]
R10  24k  [RESC1608X55N]
R11  51k  [RESC1608X55N]
R12  220  [RESC1608X55N]
R13  51k  [RESC1608X55N]
R14  24k  [RESC1608X55N]
R15  51k  [RESC1608X55N]
R16  220  [RESC1608X55N]

### Ports
LED1 (in), LED2 (in), LED3 (in), LED4 (in)

### Nets
GND: C1.1 IC1.11(V-) LD1.1(C) LD1.3(C) LD1.5(C) LD1.7(C) R2.1 R6.1 R10.1 R14.1
P3V3: C1.2 IC1.4(V+) R1.2 R5.2 R9.2 R13.2
LED1: IC1.2(IN-) ; port LED1
LED2: IC1.6(IN-) ; port LED2
LED3: IC1.9(IN-) ; port LED3
LED4: IC1.13(IN-) ; port LED4
NetIC1_1: IC1.1(OUT) R3.2 R4.1
NetIC1_3: IC1.3(IN+) R1.1 R2.2 R3.1
NetIC1_5: IC1.5(IN+) R5.1 R6.2 R7.1
NetIC1_7: IC1.7(OUT) R7.2 R8.1
NetIC1_8: IC1.8(OUT) R11.2 R12.1
NetIC1_10: IC1.10(IN+) R9.1 R10.2 R11.1
NetIC1_12: IC1.12(IN+) R13.1 R14.2 R15.1
NetIC1_14: IC1.14(OUT) R15.2 R16.1
NetLD1_2: LD1.2(A) R4.2
NetLD1_4: LD1.4(A) R8.2
NetLD1_6: LD1.6(A) R12.2
NetLD1_8: LD1.8(A) R16.2

### Channels
U_SCHMITT_LED1: designators end in _U_SCHMITT_LED1; ports LED1=Channel_TMP1 LED2=Channel_TMP2 LED3=Channel_TMP3 LED4=Channel_TMP4
U_SCHMITT_LED2: designators end in _U_SCHMITT_LED2; ports LED1=Channel_TMP5 LED2=Channel_TMP6 LED3=Channel_TMP7 LED4=Channel_TMP8

### Notes on the sheet
- Inverting Schmitt Trigger thresholds:
  V+  1.6V
  V-   0.8V
- (in symbol LED_BIVAR_H485CGDL, part A) BOT
- (in symbol LED_BIVAR_H485CGDL, part B) MBOT
- (in symbol LED_BIVAR_H485CGDL, part C) MTOP
- (in symbol LED_BIVAR_H485CGDL, part D) TOP
- (in symbol R0603_24K_1%_0.1W_100PPM) 1%
- (in symbol R0603_51K_1%_0.1W_100PPM) 1%
- (in symbol R0603_220R_1%_0.1W_100PPM) 1%

### Library data of the parts
C1 = C0402C104K4RACTU: as C1 on sheet LVDS; Supplier 1: Digi-Key; Manufacturer Part Number 1: C0402C104K4RACTU; Stock 1: 636137; Pricing 1: 1=0,10000, 10=0,04000, 50=0,02180, 100=0,01780, 500=0,01270, 1000=0,00998, 2500=0,00908, 5000=0,00835 (USD); RoHS: Yes; Mount: Surface Mount; Case/Package: 0402; Case Code (Imperial): 0402; Case Code (Metric): 1005; Contact Plating: Tin,Matte; Min Operating Temperature: -55°C; Max Operating Temperature: 125°C; Capacitance: 100nF; Tolerance: 10%; Packaging: Tape and Reel; Voltage Rating (DC): 16V; Dielectric: X7R; Package Quantity: 10000; Voltage Rating: 16V; Termination: SMD/SMT; Length: 1mm; Height: 0.5mm; Width: 0.5mm; Depth: 0.5mm; Radiation Hardening: No; ComponentLink1URL: https://datasheet.ciiva.com/45846/docfinderpartnumberc0402c102k5ractu-45846919.pdf?src-supplier=Onlinecomponents.com; ComponentLink1Description: https://datasheet.ciiva.com/45846/docfinderpartnumberc0402c102k5ractu-45846919.pdf?src-supplier=Onlinecomponents.com; ComponentLink2URL: https://datasheet.ciiva.com/18192/getdatasheetpartid-385384-18192412.pdf?src-supplier=Verical; ComponentLink2Description: https://datasheet.ciiva.com/18192/getdatasheetpartid-385384-18192412.pdf?src-supplier=Verical; Supplier Part Number 1: 399-3521-1-ND
IC1 = AD8544ARZ: Quad Operational Amplifier; Part Description: Quad CMOS Rail-to-Rail General-Purpose Amplifiers; Manufacturer: ANALOG DEVICES; PressFit: No; Bonding: No; Part Number: AD8544ARZ; Component Kind: Standard; Component Type: Standard; Device: AD8544ARZ; PackageDescription: SOIC 14, Pitch 1.27mm - Body 4x8.75mm, IPC Medium Density; Manufacturer Part Number: AD8544ARZ; Pin Count: 14; Case: SOIC14; Mounted: Yes; Socket: No; SMD: Yes; Sense: No; ComponentHeight: 1.75mm; Author: CERN DEM JLC; HelpURL: \\cern.ch\dfs\Applications\Altium\Datasheets\AD8544ARZ.pdf; CreateDate: 02.05.2012; LatestRevisionDate: 02.05.2012
LD1 = LED_BIVAR_H485CGDL: LED x4 Green 1C2A-BOT_3C4A_5C6A_7C8A-TOP; Part Description: Quad-Level 2mm Green LED, PCB Edge Mounting; Manufacturer: BIVAR; PressFit: No; Bonding: No; Part Number: LED_BIVAR_H485CGDL; Component Kind: Standard; Component Type: Standard; Color: Green; PackageDescription: Quad-Level 2mm Green, PCB Edge Mounting  BIVAR H485CHDL; Manufacturer Part Number: H485CGDL; Pin Count: 8; Mounted: Yes; Socket: No; SMD: No; Sense: No; ComponentHeight: 11.3mm; HelpURL: \\cern.ch\dfs\Applications\Altium\Datasheets\LED_BIVAR_H485CGDL.pdf; Author: CERN DEM JLC; CreateDate: 04.06.2012; LatestRevisionDate: 04.06.2012
R1 R3 R5 R7 R9 R11 R13 R15 = R0603_51K_1%_0.1W_100PPM: Resistor - 1%; Part Description: General Purpose Thick Film Chip Resistor; Manufacturer: GENERIC; Manufacturer1 Part Number: NRC06F5102TRF; Power: 0.1W; TC: ±100ppm/°C; PressFit: No; Part Number: R0603_51K_1%_0.1W_100PPM; Component Kind: Standard; Component Type: Standard; Pin Count: 2; Value: 51k; Status: Preferred; Tolerance: ±1%; Manufacturer Part Number: R0603_51K_1%_0.1W_100PPM; Case: 0603; Mounted: Yes; Sense: No; Socket: No; SMD: Yes; Manufacturer1 Example: NIC COMPONENT; Manufacturer1 ComponentHeight: 0.55mm; HelpURL: \\cern.ch\dfs\Applications\Altium\Datasheets\R0603_NIC_NRC.pdf; Author: CERN DEM JLC; CreateDate: 03.12.2007; LatestRevisionDate: 13.03.2008
R2 R6 R10 R14 = R0603_24K_1%_0.1W_100PPM: Resistor - 1%; Part Description: General Purpose Thick Film Chip Resistor; Manufacturer: GENERIC; Manufacturer1 Part Number: NRC06F2402TRF; Power: 0.1W; TC: ±100ppm/°C; PressFit: No; Part Number: R0603_24K_1%_0.1W_100PPM; Component Kind: Standard; Component Type: Standard; Pin Count: 2; Value: 24k; Status: Preferred; Tolerance: ±1%; Manufacturer Part Number: R0603_24K_1%_0.1W_100PPM; Case: 0603; Mounted: Yes; Sense: No; Socket: No; SMD: Yes; Manufacturer1 Example: NIC COMPONENT; Manufacturer1 ComponentHeight: 0.55mm; HelpURL: \\cern.ch\dfs\Applications\Altium\Datasheets\R0603_NIC_NRC.pdf; Author: CERN DEM JLC; CreateDate: 03.12.2007; LatestRevisionDate: 13.03.2008
R4 R8 R12 R16 = R0603_220R_1%_0.1W_100PPM: Resistor - 1%; Part Description: General Purpose Thick Film Chip Resistor; Manufacturer: GENERIC; Manufacturer1 Part Number: NRC06F2200TRF; Power: 0.1W; TC: ±100ppm/°C; PressFit: No; Part Number: R0603_220R_1%_0.1W_100PPM; Component Kind: Standard; Component Type: Standard; Pin Count: 2; Value: 220; Status: Preferred; Tolerance: ±1%; Manufacturer Part Number: R0603_220R_1%_0.1W_100PPM; Case: 0603; Mounted: Yes; Sense: No; Socket: No; SMD: Yes; Manufacturer1 Example: NIC COMPONENT; Manufacturer1 ComponentHeight: 0.55mm; HelpURL: \\cern.ch\dfs\Applications\Altium\Datasheets\R0603_NIC_NRC.pdf; Author: CERN DEM JLC; CreateDate: 03.12.2007; LatestRevisionDate: 13.03.2008